# EAGLE design Ganggu (EAGLE 7.2.0)
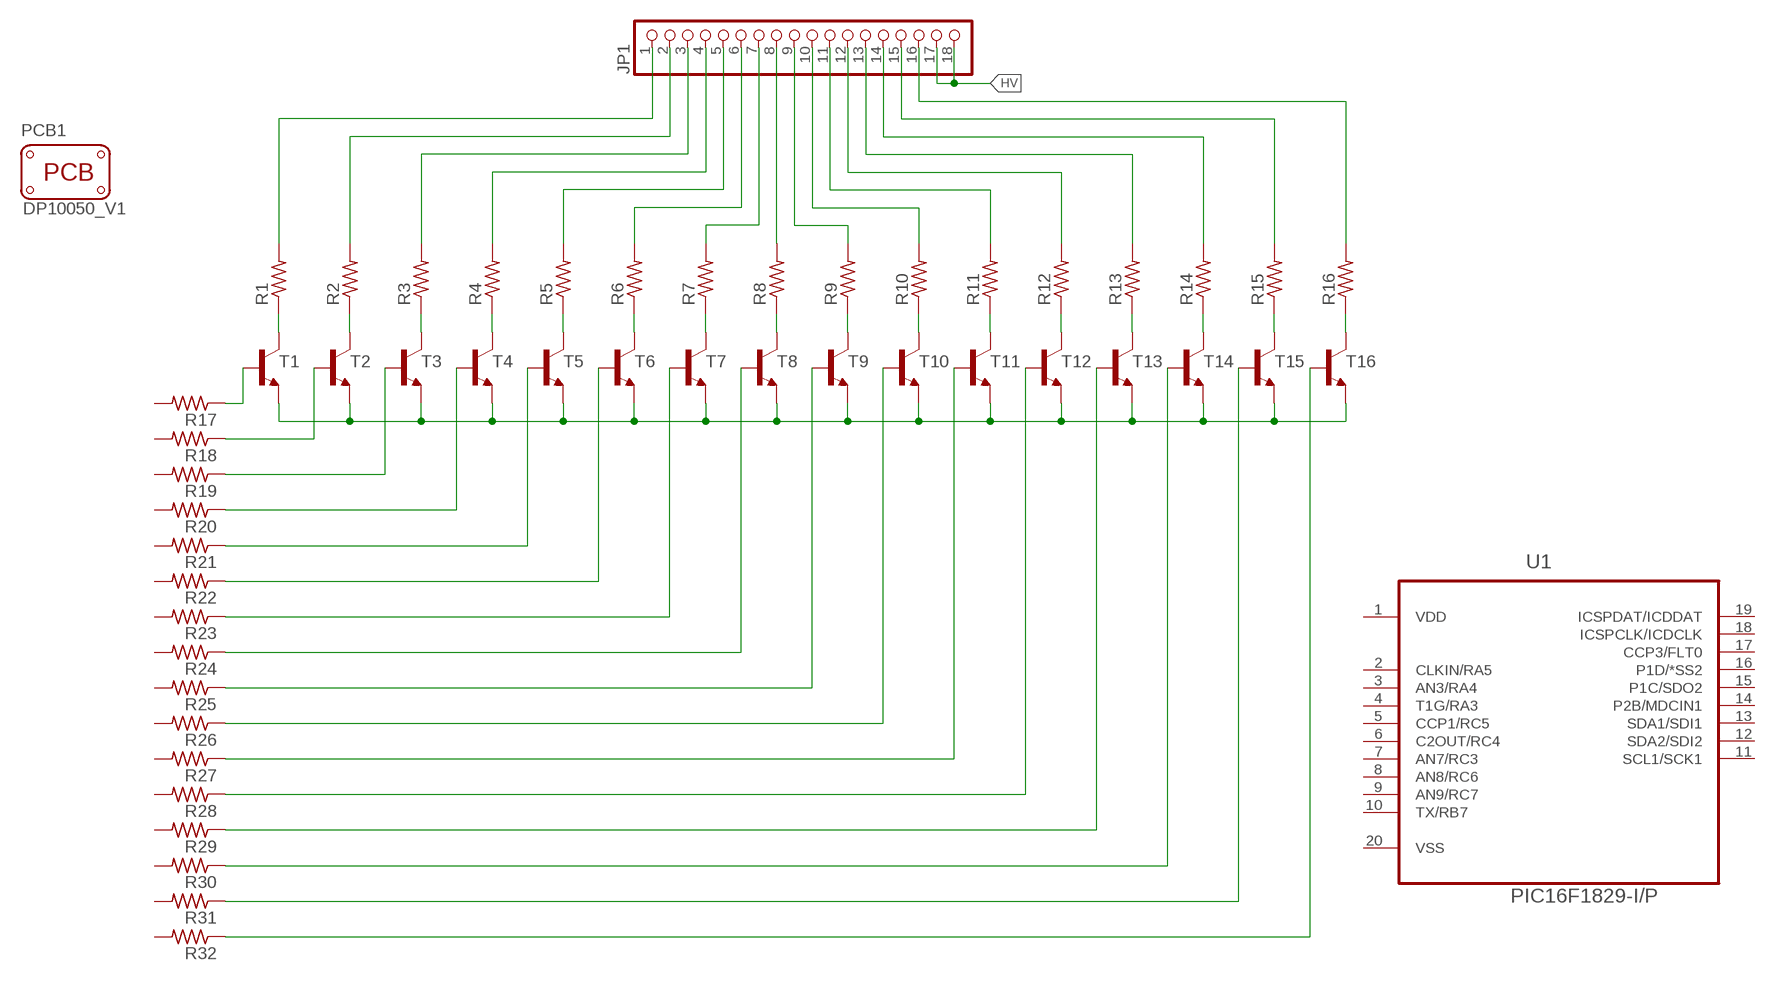
[diagram p0: schematic, sheet 1]

## Parts
JP1  PINHD-1X18  [1X18]
PCB1  PCB_DP_RECTANGLE-50X100  [DP10050_V1]
R1  R-US_0207/9  [0207/9]
R2  R-US_0207/9  [0207/9]
R3  R-US_0207/9  [0207/9]
R4  R-US_0207/9  [0207/9]
R5  R-US_0207/9  [0207/9]
R6  R-US_0207/9  [0207/9]
R7  R-US_0207/9  [0207/9]
R8  R-US_0207/9  [0207/9]
R9  R-US_0207/9  [0207/9]
R10  R-US_0207/9  [0207/9]
R11  R-US_0207/9  [0207/9]
R12  R-US_0207/9  [0207/9]
R13  R-US_0207/9  [0207/9]
R14  R-US_0207/9  [0207/9]
R15  R-US_0207/9  [0207/9]
R16  R-US_0207/9  [0207/9]
R17  R-US_0207/9  [0207/9]
R18  R-US_0207/9  [0207/9]
R19  R-US_0207/9  [0207/9]
R20  R-US_0207/9  [0207/9]
R21  R-US_0207/9  [0207/9]
R22  R-US_0207/9  [0207/9]
R23  R-US_0207/9  [0207/9]
R24  R-US_0207/9  [0207/9]
R25  R-US_0207/9  [0207/9]
R26  R-US_0207/9  [0207/9]
R27  R-US_0207/9  [0207/9]
R28  R-US_0207/9  [0207/9]
R29  R-US_0207/9  [0207/9]
R30  R-US_0207/9  [0207/9]
R31  R-US_0207/9  [0207/9]
R32  R-US_0207/9  [0207/9]
T1  2N2222  [TO92-EBC-OVAL]
T2  2N2222  [TO92-EBC-OVAL]
T3  2N2222  [TO92-EBC-OVAL]
T4  2N2222  [TO92-EBC-OVAL]
T5  2N2222  [TO92-EBC-OVAL]
T6  2N2222  [TO92-EBC-OVAL]
T7  2N2222  [TO92-EBC-OVAL]
T8  2N2222  [TO92-EBC-OVAL]
T9  2N2222  [TO92-EBC-OVAL]
T10  2N2222  [TO92-EBC-OVAL]
T11  2N2222  [TO92-EBC-OVAL]
T12  2N2222  [TO92-EBC-OVAL]
T13  2N2222  [TO92-EBC-OVAL]
T14  2N2222  [TO92-EBC-OVAL]
T15  2N2222  [TO92-EBC-OVAL]
T16  2N2222  [TO92-EBC-OVAL]
U1  PIC16F1829-I/P  [DIP254P762X508-20P]

## Nets
HV: JP1.17 JP1.18
N$1: T1.E T2.E T3.E T4.E T5.E T6.E T7.E T8.E T9.E T10.E T11.E T12.E T13.E T14.E T15.E T16.E
N$2: R1.1 T1.C
N$3: R2.1 T2.C
N$4: R3.1 T3.C
N$5: R18.1 T2.B
N$6: R4.1 T4.C
N$7: R5.1 T5.C
N$8: R6.1 T6.C
N$9: R19.1 T3.B
N$10: R7.1 T7.C
N$11: R8.1 T8.C
N$12: R9.1 T9.C
N$13: R17.1 T1.B
N$14: R10.1 T10.C
N$15: R20.1 T4.B
N$16: R11.1 T11.C
N$17: R12.1 T12.C
N$18: R13.1 T13.C
N$19: R21.1 T5.B
N$20: R14.1 T14.C
N$21: R22.1 T6.B
N$22: R15.1 T15.C
N$23: R16.1 T16.C
N$24: R23.1 T7.B
N$25: R24.1 T8.B
N$26: R25.1 T9.B
N$27: R26.1 T10.B
N$28: R27.1 T11.B
N$29: R28.1 T12.B
N$30: R29.1 T13.B
N$31: R30.1 T14.B
N$32: R31.1 T15.B
N$33: R32.1 T16.B
N$34: JP1.1 R1.2
N$35: JP1.2 R2.2
N$36: JP1.3 R3.2
N$37: JP1.4 R4.2
N$38: JP1.5 R5.2
N$39: JP1.6 R6.2
N$40: JP1.7 R7.2
N$41: JP1.8 R8.2
N$42: JP1.9 R9.2
N$43: JP1.10 R10.2
N$44: JP1.11 R11.2
N$45: JP1.12 R12.2
N$46: JP1.13 R13.2
N$47: JP1.14 R14.2
N$48: JP1.15 R15.2
N$49: JP1.16 R16.2
Unconnected: R17.2 R18.2 R19.2 R20.2 R21.2 R22.2 R23.2 R24.2 R25.2 R26.2 R27.2 R28.2 R29.2 R30.2 R31.2 R32.2 U1.2(CLKIN/RA5) U1.3(AN3/RA4) U1.4(T1G/RA3) U1.5(CCP1/RC5) U1.6(C2OUT/RC4) U1.7(AN7/RC3) U1.8(AN8/RC6) U1.9(AN9/RC7) U1.10(TX/RB7) U1.11(SCL1/SCK1) U1.12(SDA2/SDI2) U1.13(SDA1/SDI1) U1.14(P2B/MDCIN1) U1.15(P1C/SDO2) U1.16(P1D/*SS2) U1.17(CCP3/FLT0) U1.18(ICSPCLK/ICDCLK) U1.19(ICSPDAT/ICDDAT)

## Power pins joined to a net without a drawn wire
VDD: U1.1(VDD)
VSS: U1.20(VSS)

## Library data of the parts
JP1 = adafruit:PINHD-1X18: PIN HEADER
PCB1 = dp_devices:PCB_DP_RECTANGLE: Dangerous Prototypes Standard Rectangular PCB sizes; PCB_SIZE: DP10050_V1
R1-R32 = adafruit:R-US_: RESISTOR, American symbol
T1-T16 = adafruit:2N2222: NPN TRANSISTOR Big oval pads
U1 = SmallRoomLabs_uC:PIC16F1829-I/P: IC, 20-Pin Flash Microcontrollers with XLP Technology,DIP-20; MPN: PIC16F1829-I/P; OC_FARNELL: 1841451; OC_NEWARK: 83T7225; PACKAGE: DIP-20; SUPPLIER: Microchip

## Net classes
0 default: width 0.254 mm, drill 0.3 mm, clearance 0.203 mm
1 pwr: width 0.406 mm, drill 0.4 mm, clearance 0.203 mm

## Board
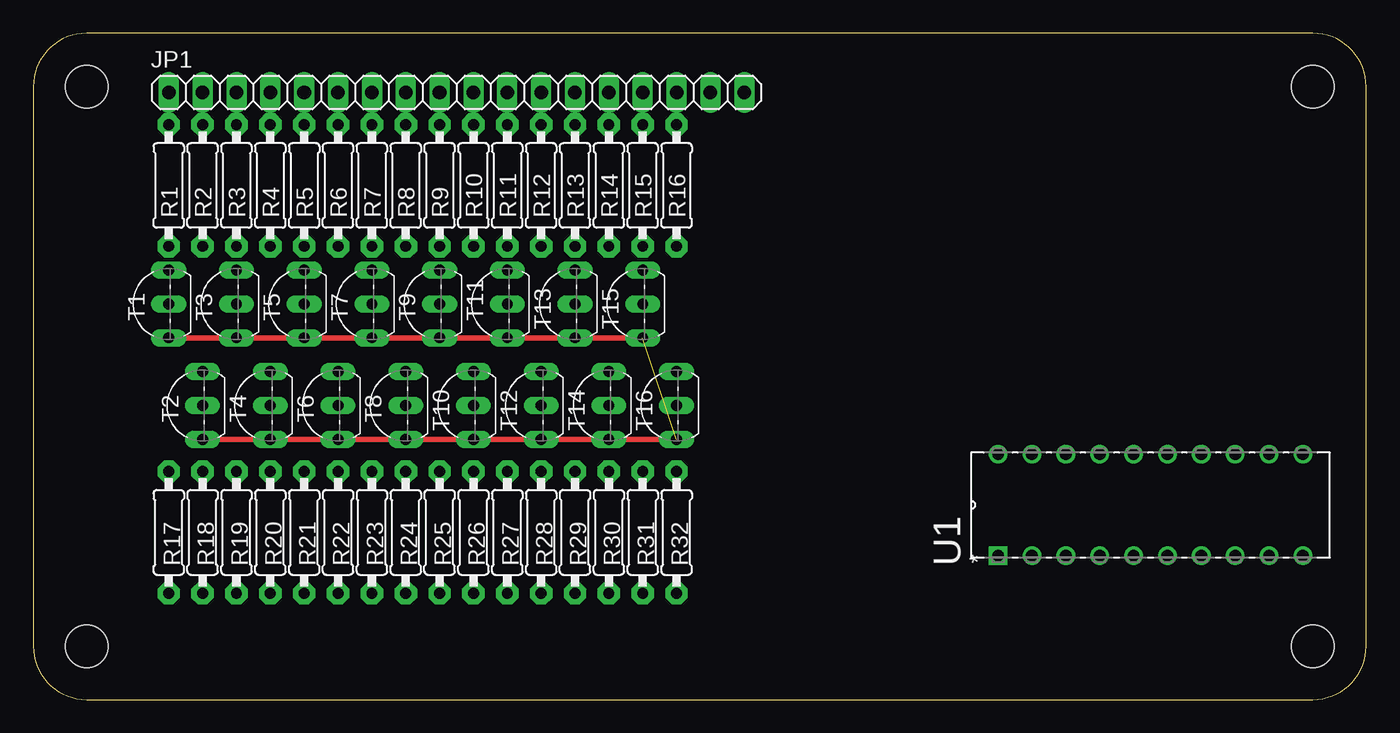
[diagram p1: board, top side]
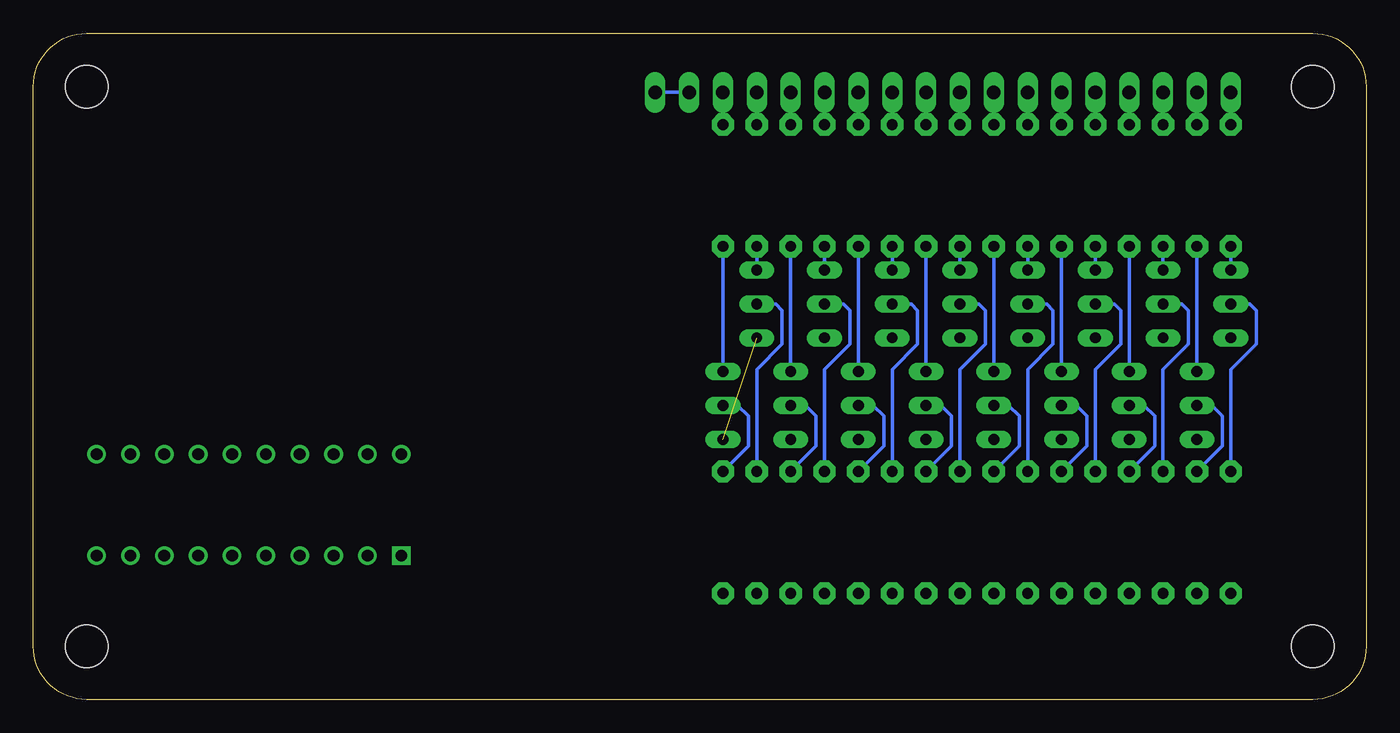
[diagram p2: board, bottom side, seen from below]

Size 100 x 50 mm. Coordinates in mm from the lower left corner, seen from the top.
Copper layers (1*16): Top 0.035mm / dielectric 1.5mm / Bottom 0.035mm
Design rules "dirt_cheap_dirty_boards.v1": minimum track width 5mil, minimum drill 12mil, track to track 5mil, track to pad 5mil, pad to pad 5mil, via to via 5mil, smd to smd 0mil, copper to edge 10mil, drill to drill 10mil, minimum pad ring 10mil, minimum via ring 6mil, stop-mask expansion 2mil, vias tented up to drill 25mil, thermal gap 10mil

### Footprints (pad centres in the part's own frame; a part is rotated, then mirrored left to right if it is on the bottom)
1X18 = drill 1.016 long: 1 -21.59,0; 2 -19.05,0; 3 -16.51,0; 4 -13.97,0; 5 -11.43,0; 6 -8.89,0; 7 -6.35,0; 8 -3.81,0; 9 -1.27,0; 10 1.27,0; 11 3.81,0; 12 6.35,0; 13 8.89,0; 14 11.43,0; 15 13.97,0; 16 16.51,0; 17 19.05,0; 18 21.59,0
DP10050_V1 = hole 3.2: -46,-21; 46,-21; 46,21; -46,21
0207/9 = drill 0.813 pad 1.676 octagon: 1 -4.572,0; 2 4.572,0
TO92-EBC-OVAL = drill 0.813 long: B 0,-1.27; C 2.54,-1.27; E -2.54,-1.27
DIP254P762X508-20P = drill 0.889 square: 1 -7.62,22.86 | drill 0.889: 2 -7.62,20.32; 3 -7.62,17.78; 4 -7.62,15.24; 5 -7.62,12.7; 6 -7.62,10.16; 7 -7.62,7.62; 8 -7.62,5.08; 9 -7.62,2.54; 10 -7.62,0; 11 0,0; 12 0,2.54; 13 0,5.08; 14 0,7.62; 15 0,10.16; 16 0,12.7; 17 0,15.24; 18 0,17.78; 19 0,20.32; 20 0,22.86

### Placement (x,y rotation side)
JP1  31.75,45.56 0 top
PCB1  50,25 0 top
R1  10.16,38.58 90 top
R2  12.7,38.58 90 top
R3  15.24,38.58 90 top
R4  17.78,38.58 90 top
R5  20.32,38.58 90 top
R6  22.86,38.58 90 top
R7  25.4,38.58 90 top
R8  27.94,38.58 90 top
R9  30.48,38.58 90 top
R10  33.02,38.58 90 top
R11  35.56,38.58 90 top
R12  38.1,38.58 90 top
R13  40.64,38.58 90 top
R14  43.18,38.58 90 top
R15  45.72,38.58 90 top
R16  48.26,38.58 90 top
R17  10.16,12.54 270 top
R18  12.7,12.54 270 top
R19  15.24,12.54 270 top
R20  17.78,12.54 270 top
R21  20.32,12.54 270 top
R22  22.86,12.54 270 top
R23  25.4,12.54 270 top
R24  27.94,12.54 270 top
R25  30.48,12.54 270 top
R26  33.02,12.54 270 top
R27  35.56,12.54 270 top
R28  38.1,12.54 270 top
R29  40.64,12.54 270 top
R30  43.18,12.54 270 top
R31  45.72,12.54 270 top
R32  48.26,12.54 270 top
T1  8.89,29.69 90 top
T2  11.43,22.07 90 top
T3  13.97,29.69 90 top
T4  16.51,22.07 90 top
T5  19.05,29.69 90 top
T6  21.59,22.07 90 top
T7  24.13,29.69 90 top
T8  26.67,22.07 90 top
T9  29.21,29.69 90 top
T10  31.75,22.07 90 top
T11  34.29,29.69 90 top
T12  36.83,22.07 90 top
T13  39.37,29.69 90 top
T14  41.91,22.07 90 top
T15  44.45,29.69 90 top
T16  46.99,22.07 90 top
U1  95.25,18.41 90 top

### Tracks (layer width: path | path; a pad name or v marks a point on that pad's centre or on a via)
HV
  Bottom 0.254: JP1.17 JP1.18
N$1  (1 unrouted)
  Top 0.406: T1.E T3.E T5.E T7.E T9.E T11.E T13.E T15.E | T16.E T14.E T12.E T10.E T8.E T6.E T4.E T2.E
N$2
  Bottom 0.254: R1.1 T1.C
N$3
  Bottom 0.254: R2.1 T2.C
N$4
  Bottom 0.254: R3.1 T3.C
N$5
  Bottom 0.254: R18.1 10.79,19.02 10.79,21.27 11.59,22.07 T2.B
N$6
  Bottom 0.254: R4.1 T4.C
N$7
  Bottom 0.254: R5.1 T5.C
N$8
  Bottom 0.254: R6.1 T6.C
N$9
  Bottom 0.254: R19.1 15.24,24.77 13.34,26.67 13.34,29.21 13.81,29.69 T3.B
N$10
  Bottom 0.254: R7.1 T7.C
N$11
  Bottom 0.254: R8.1 T8.C
N$12
  Bottom 0.254: R9.1 T9.C
N$13
  Bottom 0.254: R17.1 10.16,24.77 8.26,26.67 8.26,29.21 8.73,29.69 T1.B
N$14
  Bottom 0.254: R10.1 T10.C
N$15
  Bottom 0.254: R20.1 15.88,19.02 15.88,21.27 16.67,22.07 T4.B
N$16
  Bottom 0.254: R11.1 T11.C
N$17
  Bottom 0.254: R12.1 T12.C
N$18
  Bottom 0.254: R13.1 T13.C
N$19
  Bottom 0.254: R21.1 20.32,24.77 18.41,26.67 18.41,29.21 18.89,29.69 T5.B
N$20
  Bottom 0.254: R14.1 T14.C
N$21
  Bottom 0.254: R22.1 20.95,19.02 20.95,21.27 21.75,22.07 T6.B
N$22
  Bottom 0.254: R15.1 T15.C
N$23
  Bottom 0.254: R16.1 T16.C
N$24
  Bottom 0.254: R23.1 25.4,24.77 23.5,26.67 23.5,29.21 23.98,29.69 T7.B
N$25
  Bottom 0.254: R24.1 26.04,19.02 26.04,21.27 26.83,22.07 T8.B
N$26
  Bottom 0.254: R25.1 30.48,24.77 28.57,26.67 28.57,29.21 29.05,29.69 T9.B
N$27
  Bottom 0.254: R26.1 31.11,19.02 31.11,21.27 31.91,22.07 T10.B
N$28
  Bottom 0.254: R27.1 35.56,24.77 33.66,26.67 33.66,29.21 34.13,29.69 T11.B
N$29
  Bottom 0.254: R28.1 36.2,19.02 36.2,21.27 36.99,22.07 T12.B
N$30
  Bottom 0.254: R29.1 40.64,24.77 38.73,26.67 38.73,29.21 39.22,29.69 T13.B
N$31
  Bottom 0.254: R30.1 41.27,19.02 41.27,21.27 42.07,22.07 T14.B
N$32
  Bottom 0.254: R31.1 45.72,24.77 43.81,26.67 43.81,29.21 44.3,29.69 T15.B
N$33
  Bottom 0.254: R32.1 46.35,19.02 46.35,21.27 47.15,22.07 T16.B
N$34
  Bottom 0.254: JP1.1 R1.2
N$35
  Bottom 0.254: JP1.2 R2.2
N$36
  Bottom 0.254: JP1.3 R3.2
N$37
  Bottom 0.254: JP1.4 R4.2
N$38
  Bottom 0.254: JP1.5 R5.2
N$39
  Bottom 0.254: JP1.6 R6.2
N$40
  Bottom 0.254: JP1.7 R7.2
N$41
  Bottom 0.254: JP1.8 R8.2
N$42
  Bottom 0.254: JP1.9 R9.2
N$43
  Bottom 0.254: JP1.10 R10.2
N$44
  Bottom 0.254: JP1.11 R11.2
N$45
  Bottom 0.254: JP1.12 R12.2
N$46
  Bottom 0.254: JP1.13 R13.2
N$47
  Bottom 0.254: JP1.14 R14.2
N$48
  Bottom 0.254: JP1.15 R15.2
N$49
  Bottom 0.254: JP1.16 R16.2